# EAGLE design RE01 (EAGLE 6.3)
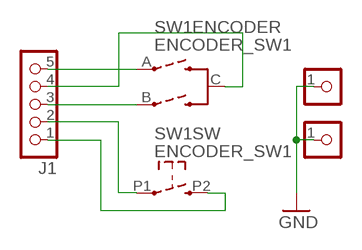
[diagram p0: schematic, sheet 1]

## Parts
H1  PROTO_VIAS_01X01  [PROTO_VIAS_01X01]
H2  PROTO_VIAS_01X01  [PROTO_VIAS_01X01]
J1  CON_HEADER_1X05-PTH  [M1X5]
SW1  ENCODER_SW1  [GENERIC_12MM_INCREMENTAL_ENCODER]

## Nets
A: J1.5 SW1.A(ENCODER:A)
B: J1.3 SW1.B(ENCODER:B)
C: J1.4 SW1.C(ENCODER:C)
GND: H1.1 H2.1
P1: J1.2 SW1.P1
P2: J1.1 SW1.P2

## Library data of the parts
H1 H2 = dp_devices:PROTO_VIAS_01X01: Single Pad for Protoboard Filling
J1 = dp_devices:CON_HEADER_1X05
SW1 = dp_devices:ENCODER_SW1: Incremental Encoder with push switch

## Board
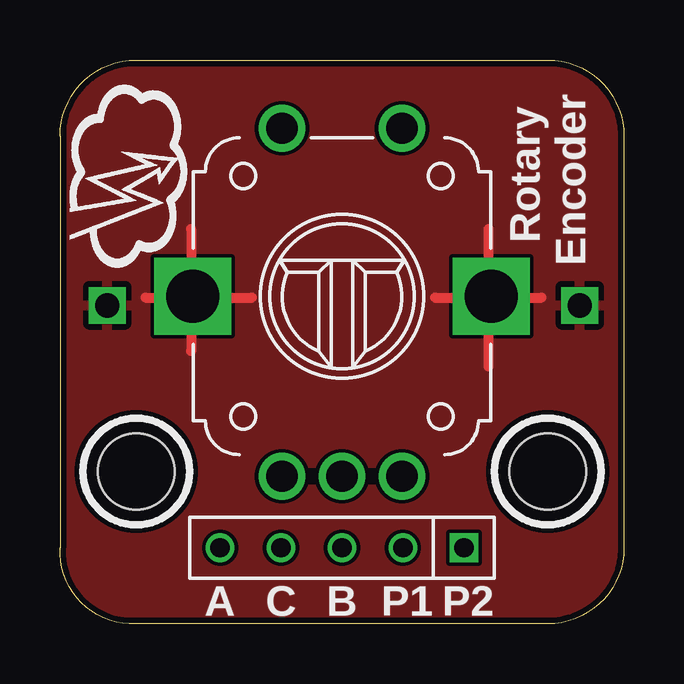
[diagram p1: board, top side]
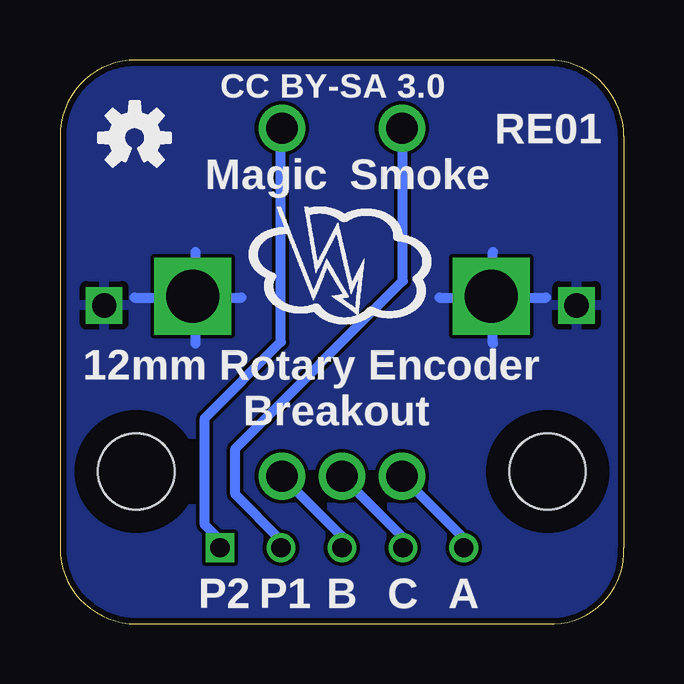
[diagram p2: board, bottom side, seen from below]

Size 23.5 x 23.5 mm. Coordinates in mm from the lower left corner, seen from the top.
Outline: 20.32,23.5 arc-90 23.5,20.32 23.5,3.18 arc-90 20.32,0 3.18,0 arc-96 0,3.18 0,20.32 arc-90 3.18,23.5 20.32,23.5
Copper layers (1*2*15*16): Top 0.035mm / dielectric 0.2mm / layer 2 0.0175mm / dielectric 1.1mm / layer 15 0.0175mm / dielectric 0.2mm / Bottom 0.035mm
Design rules "SeeedStudio_DRU_no_angle_20130527": minimum track width 6mil, minimum drill 12mil, track to track 6mil, track to pad 6mil, pad to pad 6mil, via to via 6mil, smd to smd 0mil, copper to edge 10mil, drill to drill 10mil, minimum pad ring 6mil, minimum via ring 6mil, stop-mask expansion 2mil, vias tented up to drill 25mil, thermal gap 10mil
Holes 3.17 mm at 3.18,6.35 20.32,6.35
tRestrict: area 0.6,3.8 to 5.7,8.9; area 17.8,3.8 to 22.9,8.9
bRestrict: area 0.6,3.8 to 5.7,8.9; area 17.8,3.8 to 22.9,8.9

### Footprints (pad centres in the part's own frame; a part is rotated, then mirrored left to right if it is on the bottom)
PROTO_VIAS_01X01 = drill 1.016 square: 1 0,0
M1X5 = drill 0.8 square: 1 -5.08,0 | drill 0.8: 2 -2.54,0; 3 0,0; 4 2.54,0; 5 5.08,0
GENERIC_12MM_INCREMENTAL_ENCODER = drill 1.3: A -2.5,-7.5; B 2.5,-7.5; C 0,-7.5; P1 -2.5,7; P2 2.5,7 | drill 2.2 square: GND@1 -6.219,0; GND@2 6.219,0

### Placement (x,y rotation side)
H1  1.97,13.27 0 top
H2  21.66,13.27 0 top
J1  11.75,3.18 180 top
SW1  11.75,13.65 0 top
U$1  [OSHW-LOGO-S]  20.39,20.26 0 bottom

### Tracks (layer width: path | path; a pad name or v marks a point on that pad's centre or on a via)
A
  Bottom 0.406: SW1.A 6.67,3.57 J1.5
B
  Bottom 0.406: SW1.B 11.75,3.65 J1.3
C
  Bottom 0.406: SW1.C 9.21,3.61 J1.4
GND
  Top 0.406: 5.46,16.45 5.46,11.37 | 17.85,16.45 17.85,10.73 | 15.62,13.59 20.07,13.59 | 3.56,13.59 8,13.59
  Bottom 0.406: 20.39,13.59 15.94,13.59 | 5.46,11.69 5.46,15.5 | 17.85,11.69 17.85,15.5 | 7.69,13.59 3.24,13.59
  pour Top: -1.2,24.7 24.83,24.7 24.83,-1.33 -1.2,-1.33
  pour Bottom: -0.57,24.07 24.2,24.07 24.2,-0.7 -0.57,-0.7
P1
  Bottom 0.406: SW1.P1 9.21,19.98 9.21,14.29 16.19,7.3 16.19,5.4 14.29,3.49 J1.2
P2
  Bottom 0.406: SW1.P2 14.29,19.98 14.29,11.75 17.46,8.57 17.46,4.13 16.83,3.49 J1.1

### Text on the board
tPlace: Rotary | Encoder | A | C | B | P1 | P2
bPlace: CC BY-SA 3.0 | RE01 | Smoke | Magic | 12mm Rotary Encoder | Breakout | A | C | B | P1 | P2